# Altium schematic sheet DCDC_DDS.SchDoc
size 420 x 297 mm; Address1: Address1; Address2: Address2; Address3: Address3; Address4: Address4; SheetNumber: 1; Scale: 1:1; Разраб.: Иванов; Обозначение документа: АБВГ.123456.001 Э3; Пров.: Петров; Утв.: Сидоров; Наименование организации: ОАО "Концерн "МПО-Гидроприбор"; Перв. применение: АБВГ.123456.000; Наименование изделия 1: Плата; Наименование изделия 2: Схема электрическая; Наименование изделия 3: принципиальная; Нач. отд.: Нач. отд.; Фамилия нач. отд.: Сидоров
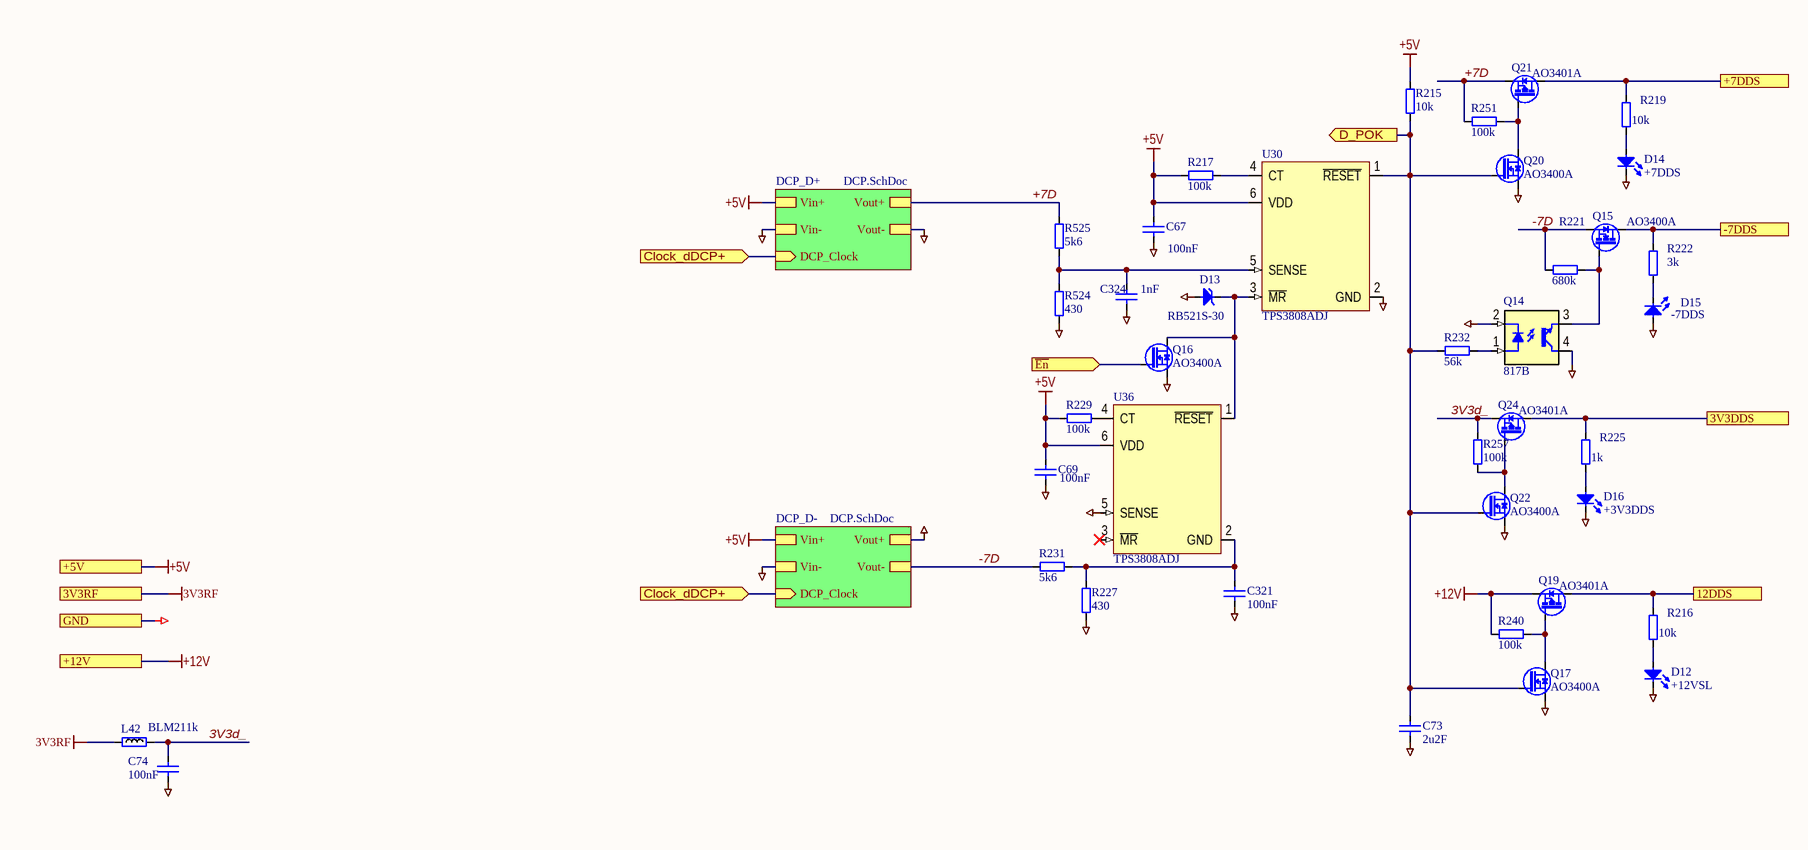
[diagram p0: DCDC_DDS.SchDoc]

## Parts
C67  100nF  [SMD0805CAP]
C69  100nF  [SMD0805CAP]
C73  2u2F  [SMD0805CAP]
C74  100nF  [SMD0805CAP]
C321  100nF  [SMD0805CAP]
C324  1nF  [SMD0805CAP]
D12  +12VSL  [LED0603]
D13  RB521S-30  [SODFL1608X65N]
D14  +7DDS  [LED0603]
D15  -7DDS  [LED0603]
D16  +3V3DDS  [LED0603]
L42  BLM211k  [RESC2012X50N]
Q14  817B  [DIP4-300]
Q15  AO3400A  [SOT95P229X119-3N]
Q16  AO3400A  [SOT95P229X119-3N]
Q17  AO3400A  [SOT95P229X119-3N]
Q19  AO3401A  [SOT95P229X119-3N]
Q20  AO3400A  [SOT95P229X119-3N]
Q21  AO3401A  [SOT95P229X119-3N]
Q22  AO3400A  [SOT95P229X119-3N]
Q24  AO3401A  [SOT95P229X119-3N]
R215  10k  [SMD0805RES]
R216  10k  [SMD0805RES]
R217  100k  [SMD0805RES]
R219  10k  [SMD0805RES]
R221  680k  [SMD0805RES]
R222  3k  [SMD0805RES]
R225  1k  [SMD0805RES]
R227  430  [SMD0805RES]
R229  100k  [SMD0805RES]
R231  5k6  [SMD0805RES]
R232  56k  [SMD0805RES]
R240  100k  [SMD0805RES]
R251  100k  [SMD0805RES]
R257  100k  [SMD0805RES]
R524  430  [SMD0805RES]
R525  5k6  [SMD0805RES]
U30  TPS3808ADJ  [SOT95P270X145-6N]
U36  TPS3808ADJ  [SOT95P270X145-6N]

## Sub-sheets
DCP_D+ = DCP.SchDoc: DCP_Clock (in), Vout+, Vout-, Vin-, Vin+
DCP_D- = DCP.SchDoc: DCP_Clock (in), Vout+, Vout-, Vin-, Vin+

## Ports
3V3DDS, 3V3RF, 12DDS, +5V, +7DDS, +12V, -7DDS, Clock_dDCP+ (in), D_POK (out), GND, ~{En} (in)

## Nets
3V3RF: L42.2 ; port 3V3RF
+5V: C67.2 C69.2 R215.1 R217.1 R229.1 U30.6(VDD) U36.6(VDD) ; port +5V, sheet DCP_D+/Vin+, sheet DCP_D-/Vin+
+12V: Q19.2(S) R240.2 ; port +12V
GND: C67.1 C69.1 C73.2 C74.1 C321.2 C324.1 D12.1(C) D13.2(A) D14.1(C) D15.2(A) D16.1(C) Q14.2(C) Q14.4(C) Q16.2(S) Q17.2(S) Q20.2(S) Q22.2(S) R227.1 R524.1 U30.2(GND) U36.5(SENSE) ; port GND, sheet DCP_D+/Vout-, sheet DCP_D+/Vin-, sheet DCP_D-/Vout+, sheet DCP_D-/Vin-
3V3d_: C74.2 L42.1 Q24.2(S) R257.1
3V3DDS: Q24.3(D) R225.2 ; port 3V3DDS
12DDS: Q19.3(D) R216.2 ; port 12DDS
+7D: Q21.2(S) R251.2 R525.1 ; sheet DCP_D+/Vout+
+7DDS: Q21.3(D) R219.2 ; port +7DDS
-7D: Q15.2(S) R221.2 R231.1 ; sheet DCP_D-/Vout-
-7DDS: Q15.3(D) R222.2 ; port -7DDS
~{En}: Q16.1(G) ; port ~{En}
Clock_dDCP+: port Clock_dDCP+, sheet DCP_D+/DCP_Clock, sheet DCP_D-/DCP_Clock
D_POK: C73.1 Q17.1(G) Q20.1(G) Q22.1(G) R215.2 R232.1 U30.1(~{RESET}) ; port D_POK
NetC321_1: C321.1 R227.2 R231.2 U36.2(GND)
NetC324_2: C324.2 R524.2 R525.2 U30.5(SENSE)
NetD12_2: D12.2(A) R216.1
NetD13_1: D13.1(C) Q16.3(D) U30.3(~{MR}) U36.1(~{RESET})
NetD14_2: D14.2(A) R219.1
NetD15_1: D15.1(C) R222.1
NetD16_2: D16.2(A) R225.1
NetQ14_1: Q14.1(A) R232.2
NetQ14_3: Q14.3(E) Q15.1(G) R221.1
NetQ17_3: Q17.3(D) Q19.1(G) R240.1
NetQ20_3: Q20.3(D) Q21.1(G) R251.1
NetQ22_3: Q22.3(D) Q24.1(G) R257.2
NetR217_2: R217.2 U30.4(CT)
NetR229_2: R229.2 U36.4(CT)

Not connected (* = marked no-connect by the designer): U36 3(~{MR})*

## Notes on the sheet
- Подп. и дата
- Инв. № дубл.
- Взам. инв. №
- Инв. № подл.
- Изм.
- Лист
- № докум.
- Подп.
- Дата
- Копировал
- Формат А3

## Library data of the parts
C67 C69 C73 C74 C321 C324 = C0805: Чип конденсатор 0805; Voltage: 25V; Vendor: Vishay; DielectricType: X5R; SMD Solders: 2; Solder Option: RM; Tolerance: 20%; Pkg: SMD0805; Device: Cap0805; Price: 2
  C67 C69 C74 C321: Value: 100nF
  C73: Value: 2u2F
  C324: Value: 1nF
D12 D14-D16 = LED0603: Чип светодиод 0603; Vendor: KB; SMD Solders: 2; Solder Option: RM; Pkg: SMD0603; Price: 10; Device: LED0603
  D12: Value: +12VSL
  D14: Value: +7DDS
  D15: Value: -7DDS
  D16: Value: +3V3DDS
D13 = RB521S-30: Чип Шоттки диод; Vendor: CTK; Voltage: 30V; SMD Solders: 2; Solder Option: RM; Pkg: SOD523; Price: 5; Device: RB521S-30; Name to order: RB521S-30
L42 = BLM21: SMD Ferrite bead 0805; Vendor: Vishay; Value: 1k; Pkg: SMD0805; SMD Solders: 2; Solder Option: RM; Price: 10; Device: BLM21
Q14 = 817B: Optotransistor; Pkg: DIP4; SMD Solders: 0; Solder Option: RM; THD Solders: 4; Vendor: UMW; Voltage: 35V; Device: 817B; Price: 10; Name to order: 817B; Current: 0
Q15-Q17 Q20 Q22 = AO3400A: NMOS; Vendor: UMW; Pkg: SOT23; SMD Solders: 3; Solder Option: RM; Voltage: 30V; Price: 10; Device: AO3400A; Name to order: AO3400A
Q19 Q21 Q24 = AO3401A: PMOS; Vendor: UMW; Pkg: SOT23; SMD Solders: 3; Solder Option: RM; THD Solders: 0; Voltage: -30V; Price: 10; Device: AO3401A; Name to order: AO3401A
R215-R217 R219 R221 R222 R225 R227 R229 R231 R232 R240 R251 R257 R524 R525 = R0805: Чип резистор 0805; Vendor: Vishay; SMD Solders: 2; Solder Option: RM; TC: 100ppm/C; Tolerance: 1%; Pkg: SMD0805; Pwr: 125mW; Device: Res0805; Price: 2
  R215 R216 R219: Value: 10k
  R217 R229 R240 R251 R257: Value: 100k
  R221: Value: 680k
  R222: Value: 3k
  R225: Value: 1k
  R227 R524: Value: 430
  R231 R525: Value: 5k6
  R232: Value: 56k
U30 U36 = TPS3808: Supervisory Circuit. Low-Quiescent-Current, Programmable-Delay; Vendor: Texas Instruments; Value: ADJ; Pkg: SOT23-6; SMD Solders: 6; Solder Option: RM; THD Solders: 0; Name to order: TPS3808G01DBV; Current: 6uA; thVoltage: 400mV; Price: 200; Device: TPS3808